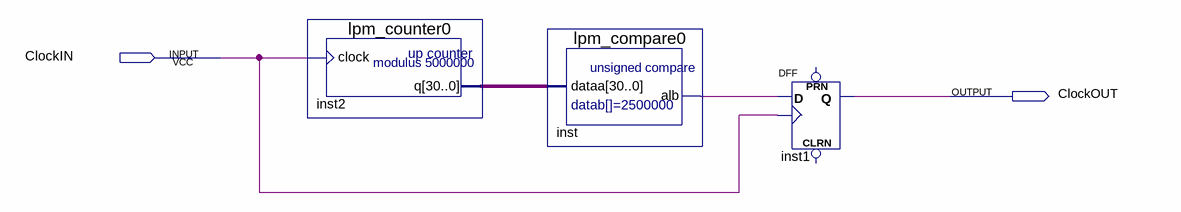
[diagram p0: schematic sheet]
// Quartus schematic freqDiv_1KHz.bdf as structural Verilog: 3 symbols, 2 pins
module freqDiv_1KHz (
  input  ClockIN,
  output ClockOUT
);

  wire inst_alb;
  wire [30:0] inst2_q;

  lpm_counter0 inst2 (.clock(ClockIN), .q(inst2_q));
  lpm_compare0 inst (.dataa(inst2_q), .alb(inst_alb));
  DFF inst1 (.CLK(ClockIN), .D(inst_alb), .Q(ClockOUT));  // open: CLRN, PRN
endmodule
